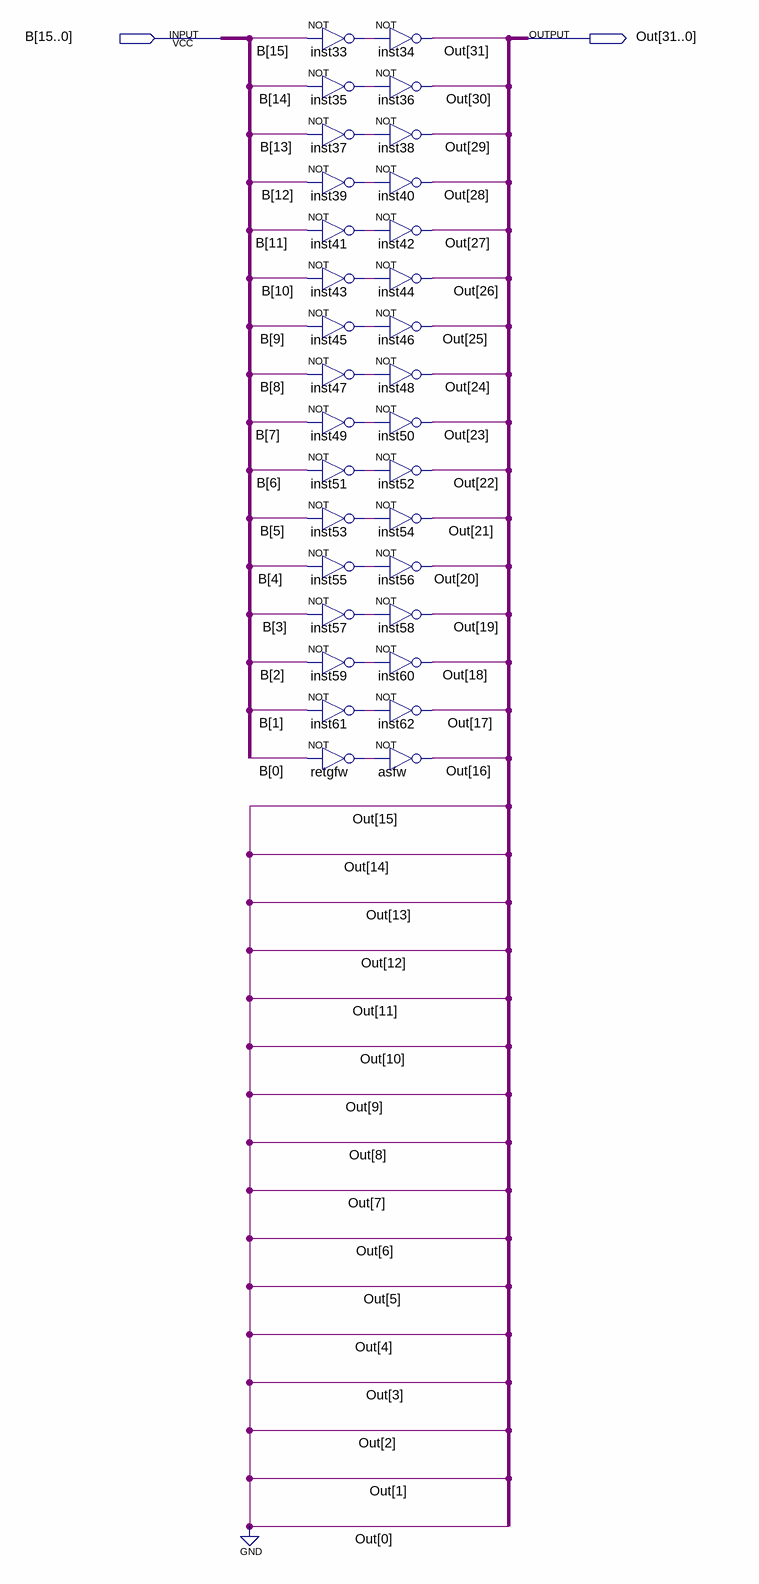
[diagram p0: schematic sheet]
// Quartus schematic LUI.bdf as structural Verilog: 32 symbols, 2 pins
module LUI (
  input  [15:0] B,
  output [31:0] Out
);

  wire inst33_out, inst35_out, inst37_out, inst39_out, inst41_out, inst43_out, inst45_out, inst47_out,
       inst49_out, inst51_out, inst53_out, inst55_out, inst57_out, inst59_out, inst61_out, retgfw_out;

  not inst33 (inst33_out, B[15]);
  not inst35 (inst35_out, B[14]);
  not inst37 (inst37_out, B[13]);
  not inst39 (inst39_out, B[12]);
  not inst41 (inst41_out, B[11]);
  not inst43 (inst43_out, B[10]);
  not inst45 (inst45_out, B[9]);
  not inst47 (inst47_out, B[8]);
  not inst49 (inst49_out, B[7]);
  not inst51 (inst51_out, B[6]);
  not inst53 (inst53_out, B[5]);
  not inst55 (inst55_out, B[4]);
  not inst57 (inst57_out, B[3]);
  not inst59 (inst59_out, B[2]);
  not inst61 (inst61_out, B[1]);
  not retgfw (retgfw_out, B[0]);
  not inst34 (Out[31], inst33_out);
  not inst36 (Out[30], inst35_out);
  not inst38 (Out[29], inst37_out);
  not inst40 (Out[28], inst39_out);
  not inst42 (Out[27], inst41_out);
  not inst44 (Out[26], inst43_out);
  not inst46 (Out[25], inst45_out);
  not inst48 (Out[24], inst47_out);
  not inst50 (Out[23], inst49_out);
  not inst52 (Out[22], inst51_out);
  not inst54 (Out[21], inst53_out);
  not inst56 (Out[20], inst55_out);
  not inst58 (Out[19], inst57_out);
  not inst60 (Out[18], inst59_out);
  not inst62 (Out[17], inst61_out);
  not asfw (Out[16], retgfw_out);

  assign Out[15:0] = {16{1'b0}};
endmodule
